# EAGLE schematic pandaLight (EAGLE 7.6.0)
DATABASE: ./../../universal-eagle/partsdb.txt

## Sheet 1 of 9: Power
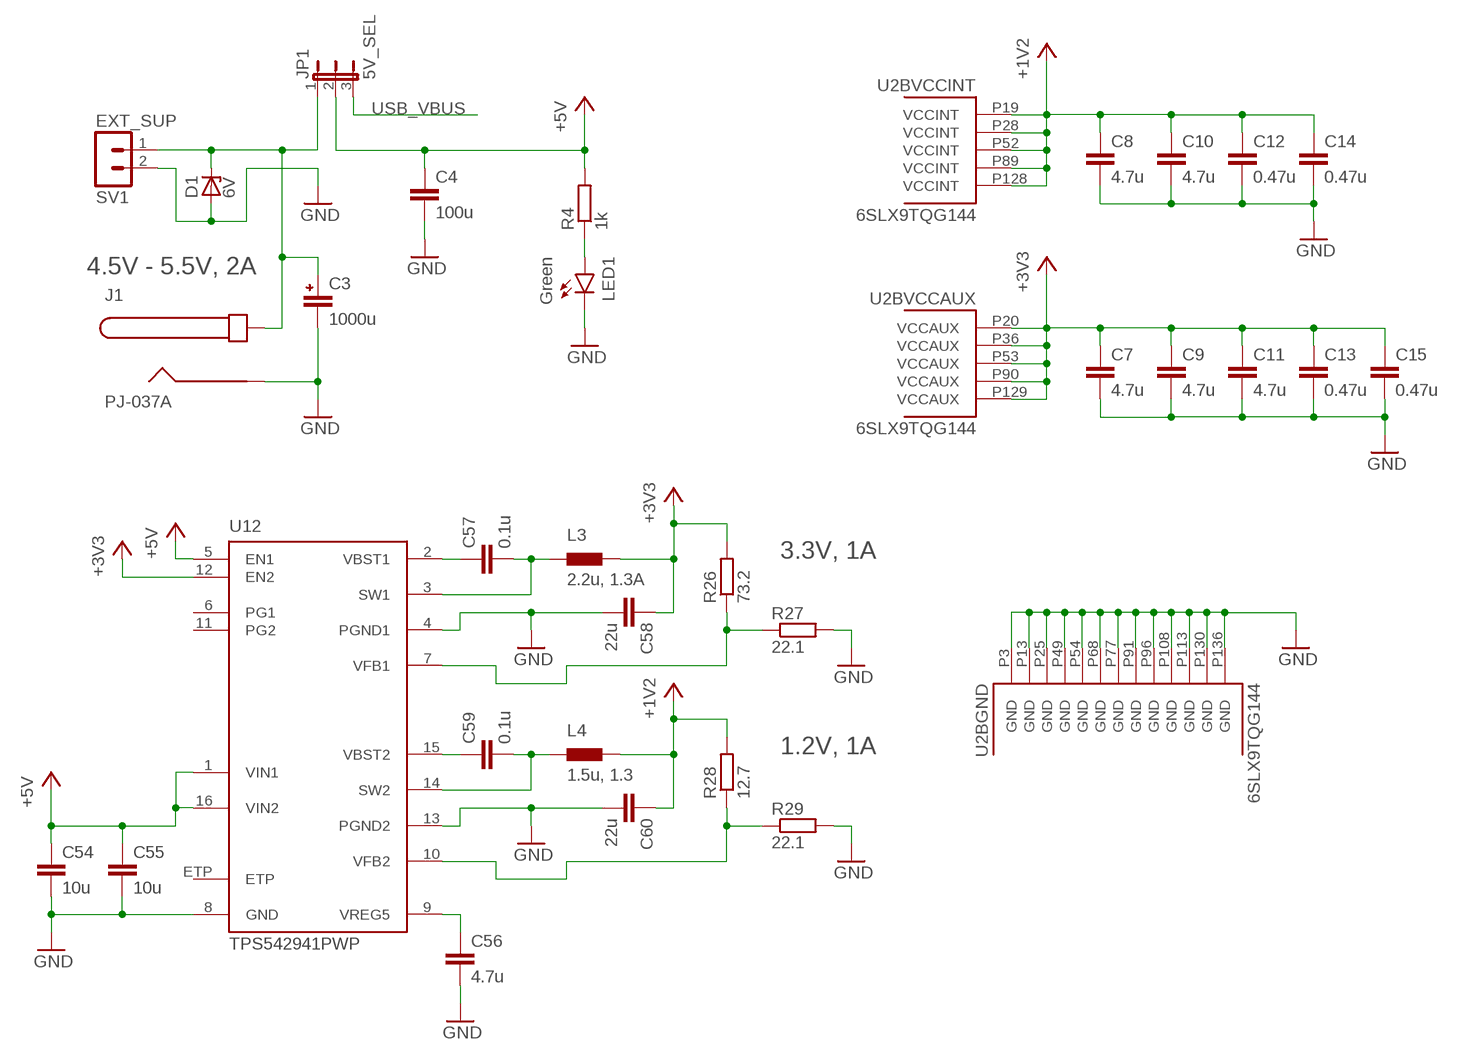
[diagram p0: schematic, sheet 1]

### Parts
C3  1000u  CAPACITOR_POL  [MVY_HA0]
C4  100u  CAPACITOR1206  [C1206]
C7  4.7u  CAPACITOR0603  [C0603]
C8  4.7u  CAPACITOR0603  [C0603]
C9  4.7u  CAPACITOR0603  [C0603]
C10  4.7u  CAPACITOR0603  [C0603]
C11  4.7u  CAPACITOR0603  [C0603]
C12  0.47u  CAPACITOR0402  [C0402]
C13  0.47u  CAPACITOR0402  [C0402]
C14  0.47u  CAPACITOR0402  [C0402]
C15  0.47u  CAPACITOR0402  [C0402]
C54  10u  CAPACITOR0603  [C0603]
C55  10u  CAPACITOR0603  [C0603]
C56  4.7u  CAPACITOR0603  [C0603]
C57  0.1u  CAPACITOR0402  [C0402]
C58  22u  CAPACITOR0603  [C0603]
C59  0.1u  CAPACITOR0402  [C0402]
C60  22u  CAPACITOR0603  [C0603]
D1  6V  ZENER_DIODE  [DO-214AC]
J1  PJ-037A  [PJ-037A]
JP1  5V_SEL  JP2E  [JP2]
L3  2.2u, 1.3A  SRN3015  [SRN3015_3X3]
L4  1.5u, 1.3  SRN3015  [SRN3015_3X3]
LED1  Green  LED0603  [LED-0603]
R4  1k  RESISTOR0402  [R0402]
R26  73.2  RESISTOR0402  [R0402]
R27  22.1  RESISTOR0402  [R0402]
R28  12.7  RESISTOR0402  [R0402]
R29  22.1  RESISTOR0402  [R0402]
SV1  EXT_SUP  MA02-1  [MA02-1]
U2  6SLX9TQG144  [TQ144]
U12  TPS542941PWP  [R-PDSO-G16]

### Nets
5V_SUP [power]: C3.1 D1.C J1.CENTER JP1.1 SV1.1 ; also sheet 4
+1V2: C8.1 C10.1 C12.1 C14.1 C60.1 L4.2 R28.2 U2.P19(BVCCINT:VCCINT) U2.P28(BVCCINT:VCCINT) U2.P52(BVCCINT:VCCINT) U2.P89(BVCCINT:VCCINT) U2.P128(BVCCINT:VCCINT)
+3V3 [power]: C7.1 C9.1 C11.1 C13.1 C15.1 C58.1 L3.2 R26.2 U2.P20(BVCCAUX:VCCAUX) U2.P36(BVCCAUX:VCCAUX) U2.P53(BVCCAUX:VCCAUX) U2.P90(BVCCAUX:VCCAUX) U2.P129(BVCCAUX:VCCAUX) U12.12(EN2) ; also sheet 2,3,4,5,6,7,8
+5V [power]: C4.1 C54.1 C55.1 JP1.2 R4.2 U12.1(VIN1) U12.5(EN1) U12.16(VIN2) ; also sheet 3,4,5,6,7
GND: C3.2 C4.2 C7.2 C8.2 C9.2 C10.2 C11.2 C12.2 C13.2 C14.2 C15.2 C54.2 C55.2 C56.2 C58.2 C60.2 D1.A J1.BARREL LED1.C R27.2 R29.2 SV1.2 U2.P3(BGND:GND) U2.P13(BGND:GND) U2.P25(BGND:GND) U2.P49(BGND:GND) U2.P54(BGND:GND) U2.P68(BGND:GND) U2.P77(BGND:GND) U2.P91(BGND:GND) U2.P96(BGND:GND) U2.P108(BGND:GND) U2.P113(BGND:GND) U2.P130(BGND:GND) U2.P136(BGND:GND) U12.4(PGND1) U12.8(GND) U12.13(PGND2) ; also sheet 2,3,4,5,6,7,8
N$3: C57.2 L3.1 U12.3(SW1)
N$4: R26.1 R27.1 U12.7(VFB1)
N$14: C57.1 U12.2(VBST1)
N$15: R28.1 R29.1 U12.10(VFB2)
N$16: C59.1 U12.15(VBST2)
N$20: C59.2 L4.1 U12.14(SW2)
N$47: LED1.A R4.1
USB_VBUS [power]: JP1.3 ; also sheet 2
VREG5: C56.1 U12.9(VREG5)
Unconnected: U12.6(PG1) U12.11(PG2) U12.ETP

### Notes on the sheet
- 4.5V - 5.5V, 2A
- 3.3V, 1A
- 1.2V, 1A

## Sheet 2 of 9: USB
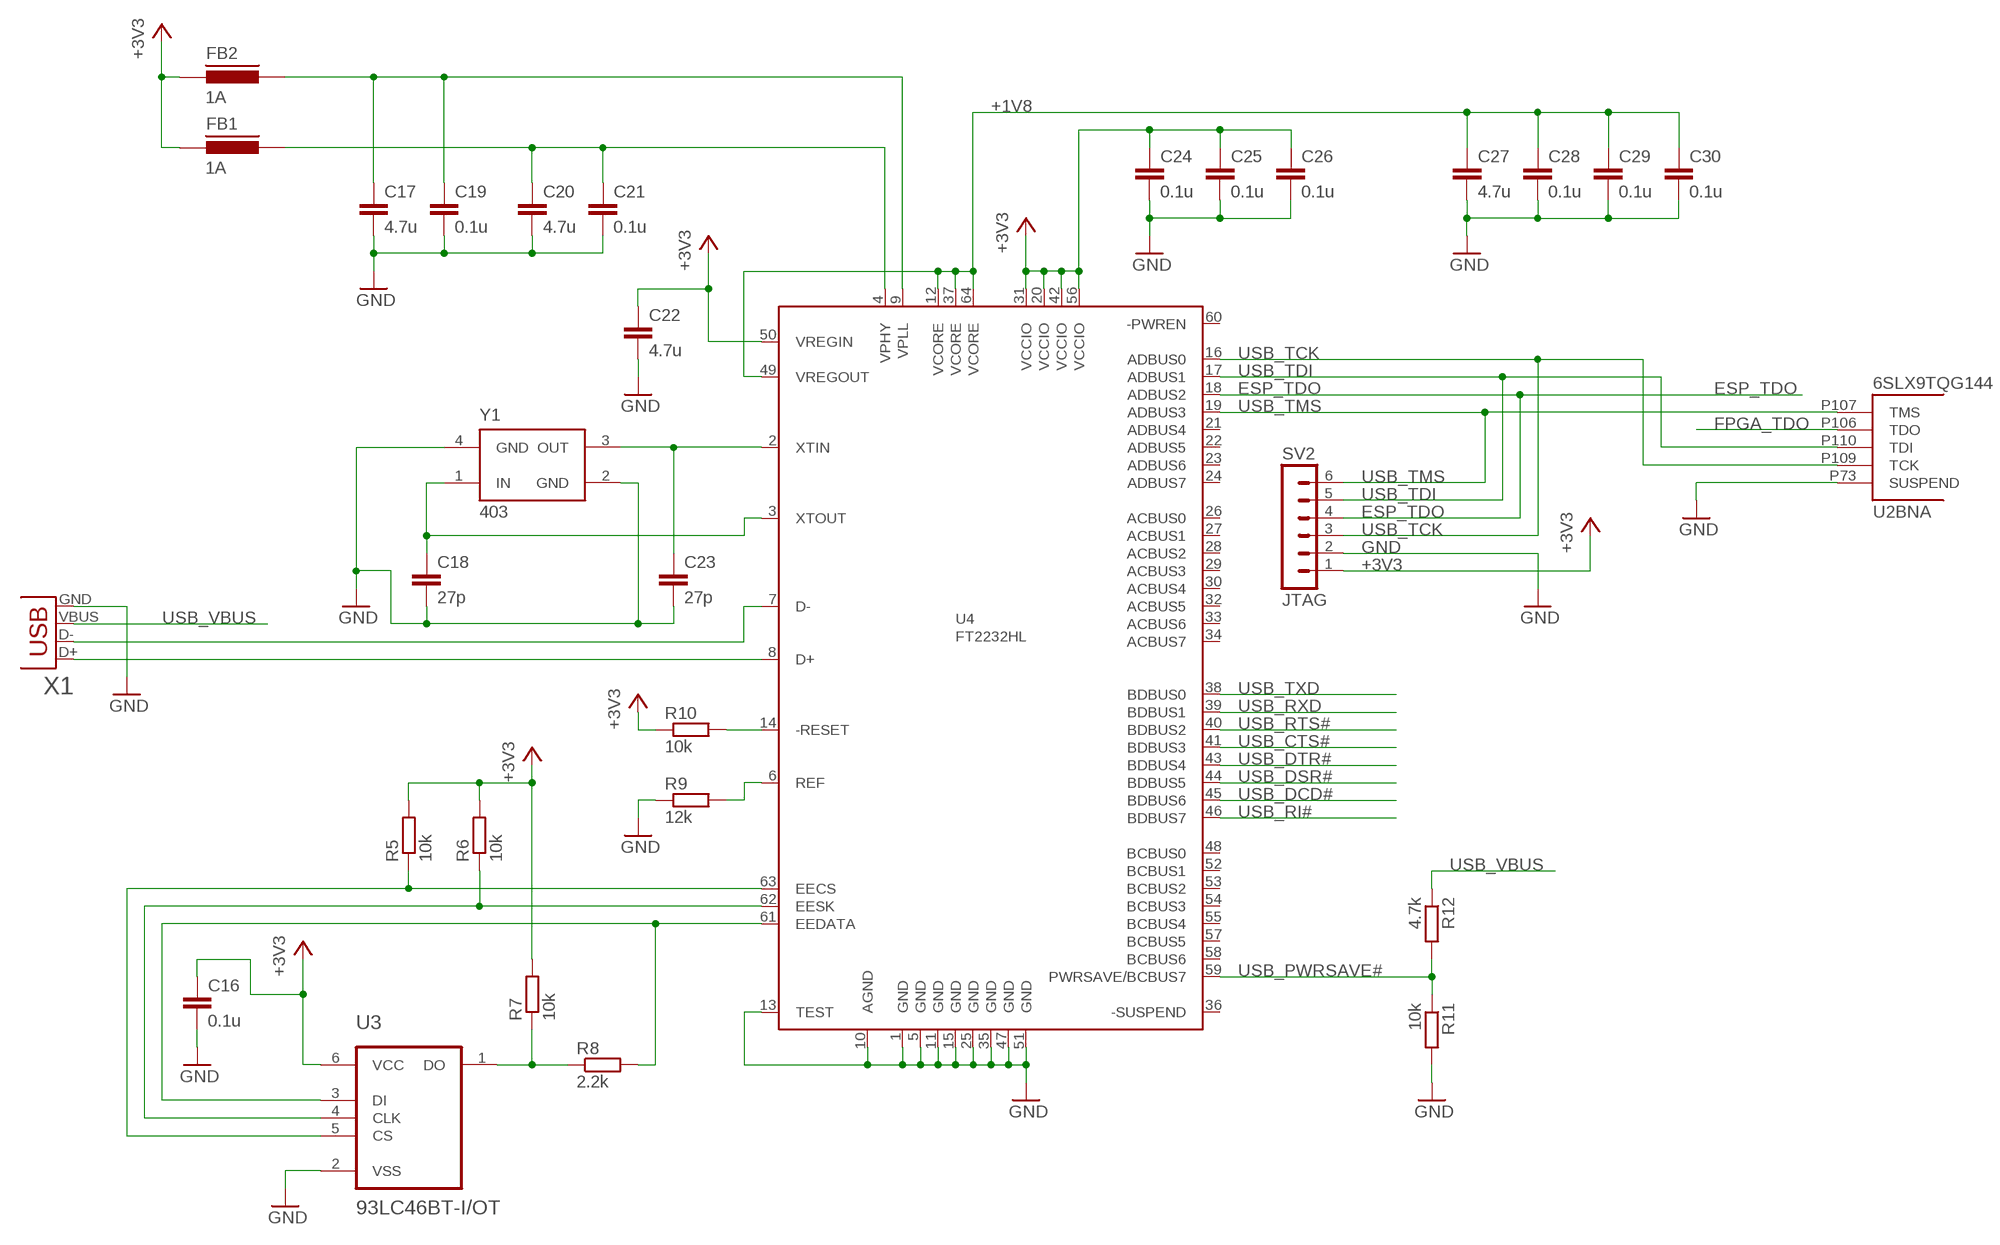
[diagram p1: schematic, sheet 2]

### Parts
C16  0.1u  CAPACITOR0402  [C0402]
C17  4.7u  CAPACITOR0603  [C0603]
C18  27p  CAPACITOR0402  [C0402]
C19  0.1u  CAPACITOR0402  [C0402]
C20  4.7u  CAPACITOR0603  [C0603]
C21  0.1u  CAPACITOR0402  [C0402]
C22  4.7u  CAPACITOR0603  [C0603]
C23  27p  CAPACITOR0402  [C0402]
C24  0.1u  CAPACITOR0402  [C0402]
C25  0.1u  CAPACITOR0402  [C0402]
C26  0.1u  CAPACITOR0402  [C0402]
C27  4.7u  CAPACITOR0603  [C0603]
C28  0.1u  CAPACITOR0402  [C0402]
C29  0.1u  CAPACITOR0402  [C0402]
C30  0.1u  CAPACITOR0402  [C0402]
FB1  1A  FERRITE0402  [FB0402]
FB2  1A  FERRITE0402  [FB0402]
R5  10k  RESISTOR0402  [R0402]
R6  10k  RESISTOR0402  [R0402]
R7  10k  RESISTOR0402  [R0402]
R8  2.2k  RESISTOR0402  [R0402]
R9  12k  RESISTOR0402  [R0402]
R10  10k  RESISTOR0402  [R0402]
R11  10k  RESISTOR0402  [R0402]
R12  4.7k  RESISTOR0402  [R0402]
SV2  JTAG  MA06-1  [MA06-1]
U3  93LC46BT-I/OT  [SOT23-6]
U4  FT2232HL  [LQFP64]
X1  USBUB-S  [USB-UB-S]
Y1  403  [403-3.2X2.5]

### Nets
+1V8 [power]: C27.1 C28.1 C29.1 C30.1 U4.12(VCORE) U4.37(VCORE) U4.49(VREGOUT) U4.64(VCORE)
+3V3 [power]: C16.1 C22.1 C24.1 C25.1 C26.1 FB1.1 FB2.1 R5.2 R6.2 R7.2 R10.1 SV2.1 U3.6(VCC) U4.20(VCCIO) U4.31(VCCIO) U4.42(VCCIO) U4.50(VREGIN) U4.56(VCCIO) ; also sheet 1,3,4,5,6,7,8
ESP_TDO: SV2.4 U4.18(ADBUS2) ; also sheet 8
FPGA_TDO: U2.P106(BNA:TDO) ; also sheet 8
GND: C16.2 C17.2 C18.2 C19.2 C20.2 C21.2 C22.2 C23.2 C24.2 C25.2 C26.2 C27.2 C28.2 C29.2 C30.2 R9.1 R11.2 SV2.2 U2.P73(BNA:SUSPEND) U3.2(VSS) U4.1(GND) U4.5(GND) U4.10(AGND) U4.11(GND) U4.13(TEST) U4.15(GND) U4.25(GND) U4.35(GND) U4.47(GND) U4.51(GND) X1.GND Y1.2(GND) Y1.4(GND) ; also sheet 1,3,4,5,6,7,8
N$1: C23.1 U4.2(XTIN) Y1.3(OUT)
N$5: C18.1 U4.3(XTOUT) Y1.1(IN)
N$6: R5.1 U3.5(CS) U4.63(EECS)
N$7: U4.7(D-) X1.D-
N$8: U4.8(D+) X1.D+
N$9: R6.1 U3.4(CLK) U4.62(EESK)
N$10: R8.2 U3.3(DI) U4.61(EEDATA)
N$11: R9.2 U4.6(REF)
N$12: R7.1 R8.1 U3.1(DO)
N$13: R10.2 U4.14(-RESET)
N$28: C20.1 C21.1 FB1.2 U4.4(VPHY)
N$31: C17.1 C19.1 FB2.2 U4.9(VPLL)
USB_CTS#: U4.41(BDBUS3) ; also sheet 4
USB_DCD#: U4.45(BDBUS6) ; also sheet 4
USB_DSR#: U4.44(BDBUS5) ; also sheet 4
USB_DTR#: U4.43(BDBUS4) ; also sheet 4
USB_PWRSAVE#: R11.1 R12.2 U4.59(PWRSAVE/BCBUS7)
USB_RI#: U4.46(BDBUS7) ; also sheet 4
USB_RTS#: U4.40(BDBUS2) ; also sheet 4
USB_RXD: U4.39(BDBUS1) ; also sheet 4
USB_TCK: SV2.3 U2.P109(BNA:TCK) U4.16(ADBUS0) ; also sheet 8
USB_TDI: SV2.5 U2.P110(BNA:TDI) U4.17(ADBUS1)
USB_TMS: SV2.6 U2.P107(BNA:TMS) U4.19(ADBUS3) ; also sheet 8
USB_TXD: U4.38(BDBUS0) ; also sheet 4
USB_VBUS [power]: R12.1 X1.VBUS ; also sheet 1
Unconnected: U4.21(ADBUS4) U4.22(ADBUS5) U4.23(ADBUS6) U4.24(ADBUS7) U4.26(ACBUS0) U4.27(ACBUS1) U4.28(ACBUS2) U4.29(ACBUS3) U4.30(ACBUS4) U4.32(ACBUS5) U4.33(ACBUS6) U4.34(ACBUS7) U4.36(-SUSPEND) U4.48(BCBUS0) U4.52(BCBUS1) U4.53(BCBUS2) U4.54(BCBUS3) U4.55(BCBUS4) U4.57(BCBUS5) U4.58(BCBUS6) U4.60(-PWREN)

## Sheet 3 of 9: B0, HDMI Rx0
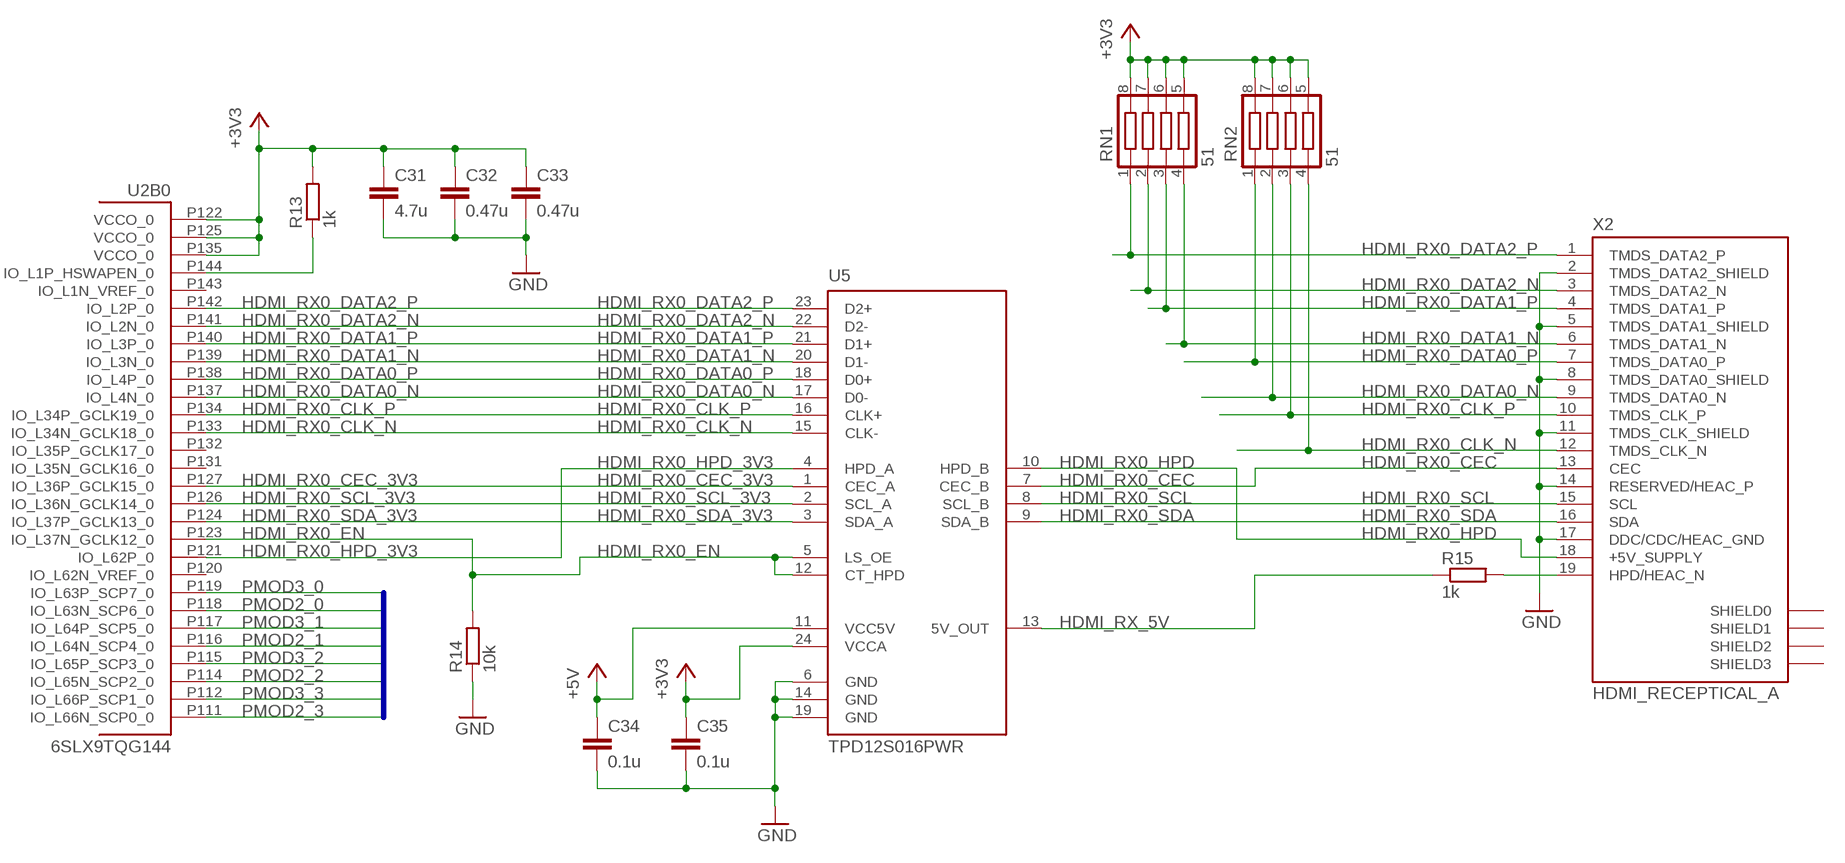
[diagram p2: schematic, sheet 3]

### Parts
C31  4.7u  CAPACITOR0603  [C0603]
C32  0.47u  CAPACITOR0402  [C0402]
C33  0.47u  CAPACITOR0402  [C0402]
C34  0.1u  CAPACITOR0402  [C0402]
C35  0.1u  CAPACITOR0402  [C0402]
R13  1k  RESISTOR0402  [R0402]
R14  10k  RESISTOR0402  [R0402]
R15  1k  RESISTOR0402  [R0402]
RN1  51  741C083  [741C083]
RN2  51  741C083  [741C083]
U5  TPD12S016PWR  [PW_R-PDSO-G24]
X2  HDMI_RECEPTICAL_A  [HDMI_TYPE_A_RECEPTICAL]

### Nets
+3V3 [power]: C31.1 C32.1 C33.1 C35.1 R13.2 RN1.5 RN1.6 RN1.7 RN1.8 RN2.5 RN2.6 RN2.7 RN2.8 U2.P122(B0:VCCO_0) U2.P125(B0:VCCO_0) U2.P135(B0:VCCO_0) U5.24(VCCA) ; also sheet 1,2,4,5,6,7,8
+5V [power]: C34.1 U5.11(VCC5V) ; also sheet 1,4,5,6,7
GND: C31.2 C32.2 C33.2 C34.2 C35.2 R14.1 U5.6(GND) U5.14(GND) U5.19(GND) X2.2(TMDS_DATA2_SHIELD) X2.5(TMDS_DATA1_SHIELD) X2.8(TMDS_DATA0_SHIELD) X2.11(TMDS_CLK_SHIELD) X2.14(RESERVED/HEAC_P) X2.17(DDC/CDC/HEAC_GND) ; also sheet 1,2,4,5,6,7,8
HDMI_RX0_CEC: U5.7(CEC_B) X2.13(CEC)
HDMI_RX0_CEC_3V3: U2.P127(B0:IO_L36P_GCLK15_0) U5.1(CEC_A)
HDMI_RX0_CLK_N [tmds]: RN2.4 U2.P133(B0:IO_L34N_GCLK18_0) U5.15(CLK-) X2.12(TMDS_CLK_N)
HDMI_RX0_CLK_P [tmds]: RN2.3 U2.P134(B0:IO_L34P_GCLK19_0) U5.16(CLK+) X2.10(TMDS_CLK_P)
HDMI_RX0_DATA0_N [tmds]: RN2.2 U2.P137(B0:IO_L4N_0) U5.17(D0-) X2.9(TMDS_DATA0_N)
HDMI_RX0_DATA0_P [tmds]: RN2.1 U2.P138(B0:IO_L4P_0) U5.18(D0+) X2.7(TMDS_DATA0_P)
HDMI_RX0_DATA1_N [tmds]: RN1.4 U2.P139(B0:IO_L3N_0) U5.20(D1-) X2.6(TMDS_DATA1_N)
HDMI_RX0_DATA1_P [tmds]: RN1.3 U2.P140(B0:IO_L3P_0) U5.21(D1+) X2.4(TMDS_DATA1_P)
HDMI_RX0_DATA2_N [tmds]: RN1.2 U2.P141(B0:IO_L2N_0) U5.22(D2-) X2.3(TMDS_DATA2_N)
HDMI_RX0_DATA2_P [tmds]: RN1.1 U2.P142(B0:IO_L2P_0) U5.23(D2+) X2.1(TMDS_DATA2_P)
HDMI_RX0_EN: R14.2 U2.P123(B0:IO_L37N_GCLK12_0) U5.5(LS_OE) U5.12(CT_HPD)
HDMI_RX0_HPD: U5.10(HPD_B) X2.18(+5V_SUPPLY)
HDMI_RX0_HPD_3V3: U2.P121(B0:IO_L62P_0) U5.4(HPD_A)
HDMI_RX0_SCL: U5.8(SCL_B) X2.15(SCL)
HDMI_RX0_SCL_3V3: U2.P126(B0:IO_L36N_GCLK14_0) U5.2(SCL_A)
HDMI_RX0_SDA: U5.9(SDA_B) X2.16(SDA)
HDMI_RX0_SDA_3V3: U2.P124(B0:IO_L37P_GCLK13_0) U5.3(SDA_A)
HDMI_RX_5V: R15.1 U5.13(5V_OUT)
N$35: R13.1 U2.P144(B0:IO_L1P_HSWAPEN_0)
N$50: R15.2 X2.19(HPD/HEAC_N)
PMOD2_0: U2.P118(B0:IO_L63N_SCP6_0) ; also sheet 7
PMOD2_1: U2.P116(B0:IO_L64N_SCP4_0) ; also sheet 7
PMOD2_2: U2.P114(B0:IO_L65N_SCP2_0) ; also sheet 7
PMOD2_3: U2.P111(B0:IO_L66N_SCP0_0) ; also sheet 7
PMOD3_0: U2.P119(B0:IO_L63P_SCP7_0) ; also sheet 7
PMOD3_1: U2.P117(B0:IO_L64P_SCP5_0) ; also sheet 7
PMOD3_2: U2.P115(B0:IO_L65P_SCP3_0) ; also sheet 7
PMOD3_3: U2.P112(B0:IO_L66P_SCP1_0) ; also sheet 7
Unconnected: U2.P120(B0:IO_L62N_VREF_0) U2.P131(B0:IO_L35N_GCLK16_0) U2.P132(B0:IO_L35P_GCLK17_0) U2.P143(B0:IO_L1N_VREF_0) X2.SHIELD0 X2.SHIELD1 X2.SHIELD2 X2.SHIELD3

### Buses
PMOD2_[0..3],PMOD3_[0..3]

## Sheet 4 of 9: B1, LEDs
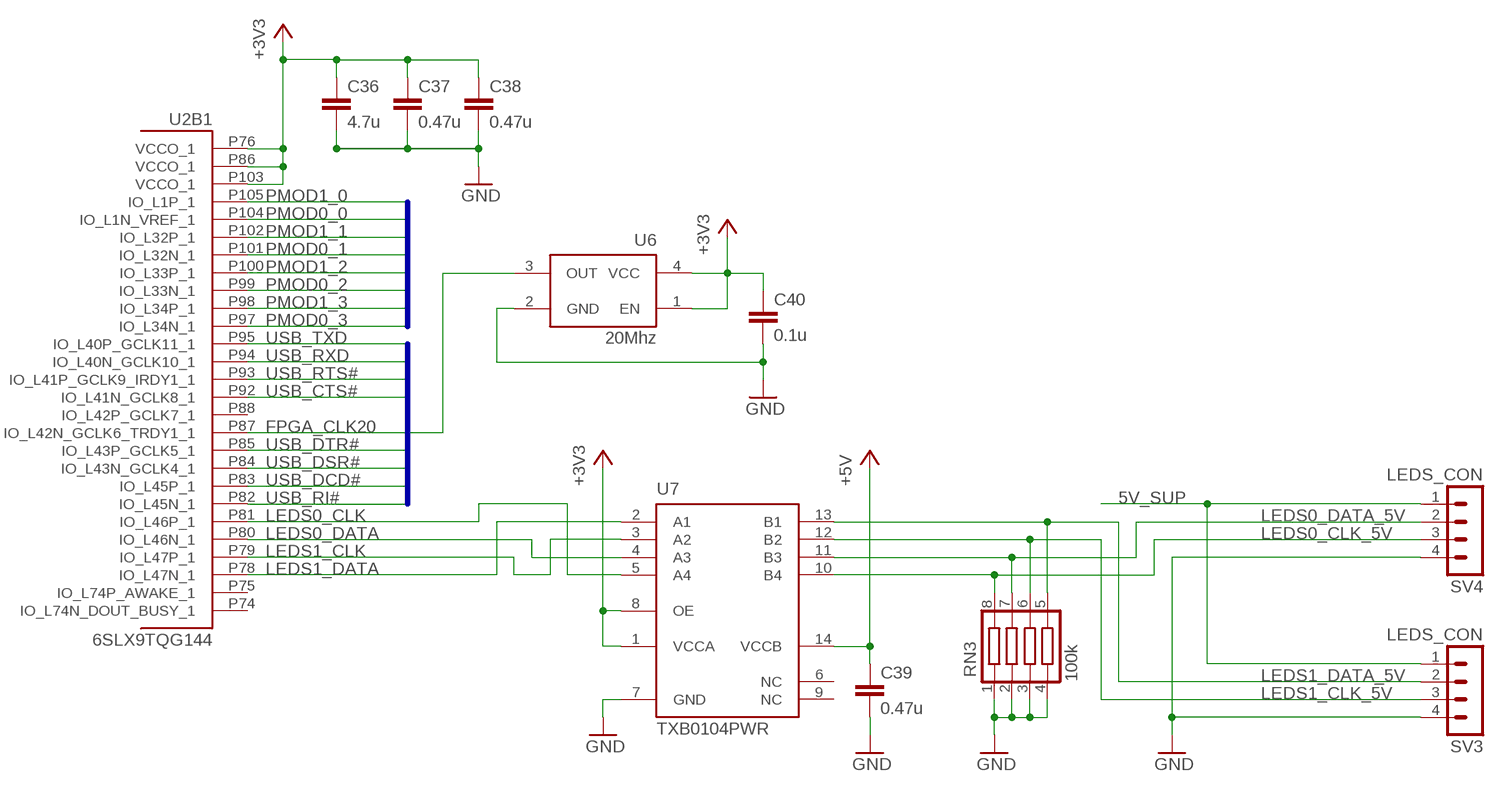
[diagram p3: schematic, sheet 4]

### Parts
C36  4.7u  CAPACITOR0603  [C0603]
C37  0.47u  CAPACITOR0402  [C0402]
C38  0.47u  CAPACITOR0402  [C0402]
C39  0.47u  CAPACITOR0402  [C0402]
C40  0.1u  CAPACITOR0402  [C0402]
RN3  100k  741C083  [741C083]
SV3  LEDS_CON  MA04-1  [MA04-1]
SV4  LEDS_CON  MA04-1  [MA04-1]
U6  20Mhz  OSCILLATOR  [OSCI-1.6X1.2]
U7  TXB0104PWR  [R-PDSO-G14]

### Nets
5V_SUP [power]: SV3.1 SV4.1 ; also sheet 1
+3V3 [power]: C36.1 C37.1 C38.1 C40.1 U2.P76(B1:VCCO_1) U2.P86(B1:VCCO_1) U2.P103(B1:VCCO_1) U6.1(EN) U6.4(VCC) U7.1(VCCA) U7.8(OE) ; also sheet 1,2,3,5,6,7,8
+5V [power]: C39.1 U7.14(VCCB) ; also sheet 1,3,5,6,7
FPGA_CLK20: U2.P87(B1:IO_L42N_GCLK6_TRDY1_1) U6.3(OUT)
GND: C36.2 C37.2 C38.2 C39.2 C40.2 RN3.1 RN3.2 RN3.3 RN3.4 SV3.4 SV4.4 U6.2(GND) U7.7(GND) ; also sheet 1,2,3,5,6,7,8
LEDS0_CLK: U2.P81(B1:IO_L46P_1) U7.5(A4)
LEDS0_CLK_5V: RN3.8 SV4.3 U7.10(B4)
LEDS0_DATA: U2.P80(B1:IO_L46N_1) U7.4(A3)
LEDS0_DATA_5V: RN3.7 SV4.2 U7.11(B3)
LEDS1_CLK: U2.P79(B1:IO_L47P_1) U7.3(A2)
LEDS1_CLK_5V: RN3.6 SV3.3 U7.12(B2)
LEDS1_DATA: U2.P78(B1:IO_L47N_1) U7.2(A1)
LEDS1_DATA_5V: RN3.5 SV3.2 U7.13(B1)
PMOD0_0: U2.P104(B1:IO_L1N_VREF_1) ; also sheet 7
PMOD0_1: U2.P101(B1:IO_L32N_1) ; also sheet 7
PMOD0_2: U2.P99(B1:IO_L33N_1) ; also sheet 7
PMOD0_3: U2.P97(B1:IO_L34N_1) ; also sheet 7
PMOD1_0: U2.P105(B1:IO_L1P_1) ; also sheet 7
PMOD1_1: U2.P102(B1:IO_L32P_1) ; also sheet 7
PMOD1_2: U2.P100(B1:IO_L33P_1) ; also sheet 7
PMOD1_3: U2.P98(B1:IO_L34P_1) ; also sheet 7
USB_CTS#: U2.P92(B1:IO_L41N_GCLK8_1) ; also sheet 2
USB_DCD#: U2.P83(B1:IO_L45P_1) ; also sheet 2
USB_DSR#: U2.P84(B1:IO_L43N_GCLK4_1) ; also sheet 2
USB_DTR#: U2.P85(B1:IO_L43P_GCLK5_1) ; also sheet 2
USB_RI#: U2.P82(B1:IO_L45N_1) ; also sheet 2
USB_RTS#: U2.P93(B1:IO_L41P_GCLK9_IRDY1_1) ; also sheet 2
USB_RXD: U2.P94(B1:IO_L40N_GCLK10_1) ; also sheet 2
USB_TXD: U2.P95(B1:IO_L40P_GCLK11_1) ; also sheet 2
Unconnected: U2.P74(B1:IO_L74N_DOUT_BUSY_1) U2.P75(B1:IO_L74P_AWAKE_1) U2.P88(B1:IO_L42P_GCLK7_1) U7.6(NC) U7.9(NC)

### Buses
PMOD0_[0..3],PMOD1_[0..3]
USB_RI#,USB_DCD#,USB_DSR#,USB_DTR#,USB_TXD,USB_RXD,USB_RTS#,USB_CTS#

## Sheet 5 of 9: B2, HDMI Tx
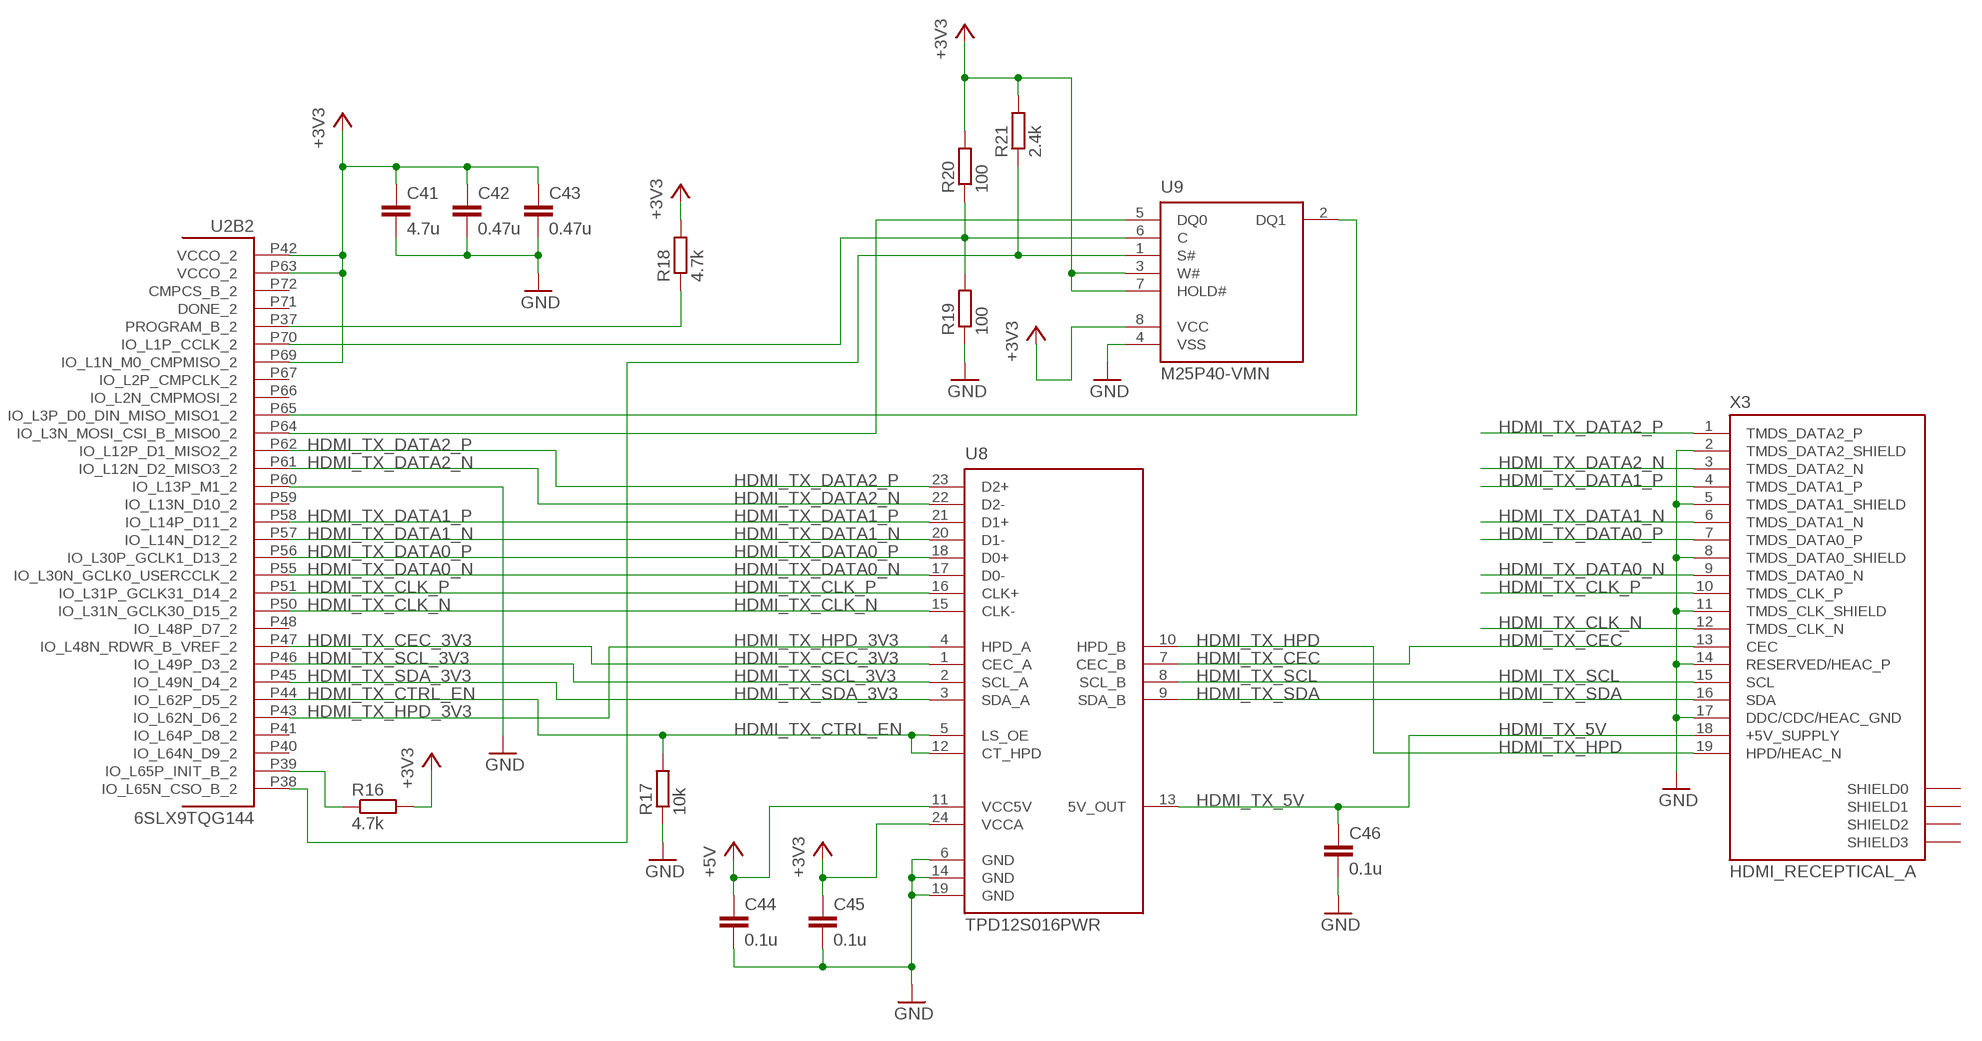
[diagram p4: schematic, sheet 5]

### Parts
C41  4.7u  CAPACITOR0603  [C0603]
C42  0.47u  CAPACITOR0402  [C0402]
C43  0.47u  CAPACITOR0402  [C0402]
C44  0.1u  CAPACITOR0402  [C0402]
C45  0.1u  CAPACITOR0402  [C0402]
C46  0.1u  CAPACITOR0402  [C0402]
R16  4.7k  RESISTOR0402  [R0402]
R17  10k  RESISTOR0402  [R0402]
R18  4.7k  RESISTOR0402  [R0402]
R19  100  RESISTOR0402  [R0402]
R20  100  RESISTOR0402  [R0402]
R21  2.4k  RESISTOR0402  [R0402]
U8  TPD12S016PWR  [PW_R-PDSO-G24]
U9  M25P40-VMN  [SO8N]
X3  HDMI_RECEPTICAL_A  [HDMI_TYPE_A_RECEPTICAL]

### Nets
+3V3 [power]: C41.1 C42.1 C43.1 C45.1 R16.2 R18.2 R20.2 R21.2 U2.P42(B2:VCCO_2) U2.P63(B2:VCCO_2) U2.P69(B2:IO_L1N_M0_CMPMISO_2) U8.24(VCCA) U9.3(W#) U9.7(HOLD#) U9.8(VCC) ; also sheet 1,2,3,4,6,7,8
+5V [power]: C44.1 U8.11(VCC5V) ; also sheet 1,3,4,6,7
GND: C41.2 C42.2 C43.2 C44.2 C45.2 C46.2 R17.1 R19.1 U2.P60(B2:IO_L13P_M1_2) U8.6(GND) U8.14(GND) U8.19(GND) U9.4(VSS) X3.2(TMDS_DATA2_SHIELD) X3.5(TMDS_DATA1_SHIELD) X3.8(TMDS_DATA0_SHIELD) X3.11(TMDS_CLK_SHIELD) X3.14(RESERVED/HEAC_P) X3.17(DDC/CDC/HEAC_GND) ; also sheet 1,2,3,4,6,7,8
HDMI_TX_5V [power]: C46.1 U8.13(5V_OUT) X3.18(+5V_SUPPLY)
HDMI_TX_CEC: U8.7(CEC_B) X3.13(CEC)
HDMI_TX_CEC_3V3: U2.P47(B2:IO_L48N_RDWR_B_VREF_2) U8.1(CEC_A)
HDMI_TX_CLK_N [tmds]: U2.P50(B2:IO_L31N_GCLK30_D15_2) U8.15(CLK-) X3.12(TMDS_CLK_N)
HDMI_TX_CLK_P [tmds]: U2.P51(B2:IO_L31P_GCLK31_D14_2) U8.16(CLK+) X3.10(TMDS_CLK_P)
HDMI_TX_CTRL_EN: R17.2 U2.P44(B2:IO_L62P_D5_2) U8.5(LS_OE) U8.12(CT_HPD)
HDMI_TX_DATA0_N [tmds]: U2.P55(B2:IO_L30N_GCLK0_USERCCLK_2) U8.17(D0-) X3.9(TMDS_DATA0_N)
HDMI_TX_DATA0_P [tmds]: U2.P56(B2:IO_L30P_GCLK1_D13_2) U8.18(D0+) X3.7(TMDS_DATA0_P)
HDMI_TX_DATA1_N [tmds]: U2.P57(B2:IO_L14N_D12_2) U8.20(D1-) X3.6(TMDS_DATA1_N)
HDMI_TX_DATA1_P [tmds]: U2.P58(B2:IO_L14P_D11_2) U8.21(D1+) X3.4(TMDS_DATA1_P)
HDMI_TX_DATA2_N [tmds]: U2.P61(B2:IO_L12N_D2_MISO3_2) U8.22(D2-) X3.3(TMDS_DATA2_N)
HDMI_TX_DATA2_P [tmds]: U2.P62(B2:IO_L12P_D1_MISO2_2) U8.23(D2+) X3.1(TMDS_DATA2_P)
HDMI_TX_HPD: U8.10(HPD_B) X3.19(HPD/HEAC_N)
HDMI_TX_HPD_3V3: U2.P43(B2:IO_L62N_D6_2) U8.4(HPD_A)
HDMI_TX_SCL: U8.8(SCL_B) X3.15(SCL)
HDMI_TX_SCL_3V3: U2.P46(B2:IO_L49P_D3_2) U8.2(SCL_A)
HDMI_TX_SDA: U8.9(SDA_B) X3.16(SDA)
HDMI_TX_SDA_3V3: U2.P45(B2:IO_L49N_D4_2) U8.3(SDA_A)
N$34: R18.1 U2.P37(B2:PROGRAM_B_2)
N$39: R16.1 U2.P39(B2:IO_L65P_INIT_B_2)
N$40: U2.P64(B2:IO_L3N_MOSI_CSI_B_MISO0_2) U9.5(DQ0)
N$41: R21.1 U2.P38(B2:IO_L65N_CSO_B_2) U9.1(S#)
N$42: R19.2 R20.1 U2.P70(B2:IO_L1P_CCLK_2) U9.6(C)
N$43: U2.P65(B2:IO_L3P_D0_DIN_MISO_MISO1_2) U9.2(DQ1)
Unconnected: U2.P40(B2:IO_L64N_D9_2) U2.P41(B2:IO_L64P_D8_2) U2.P48(B2:IO_L48P_D7_2) U2.P59(B2:IO_L13N_D10_2) U2.P66(B2:IO_L2N_CMPMOSI_2) U2.P67(B2:IO_L2P_CMPCLK_2) U2.P71(B2:DONE_2) U2.P72(B2:CMPCS_B_2) X3.SHIELD0 X3.SHIELD1 X3.SHIELD2 X3.SHIELD3

## Sheet 6 of 9: B3, HDMI Rx1, Bluetooth/WiFi
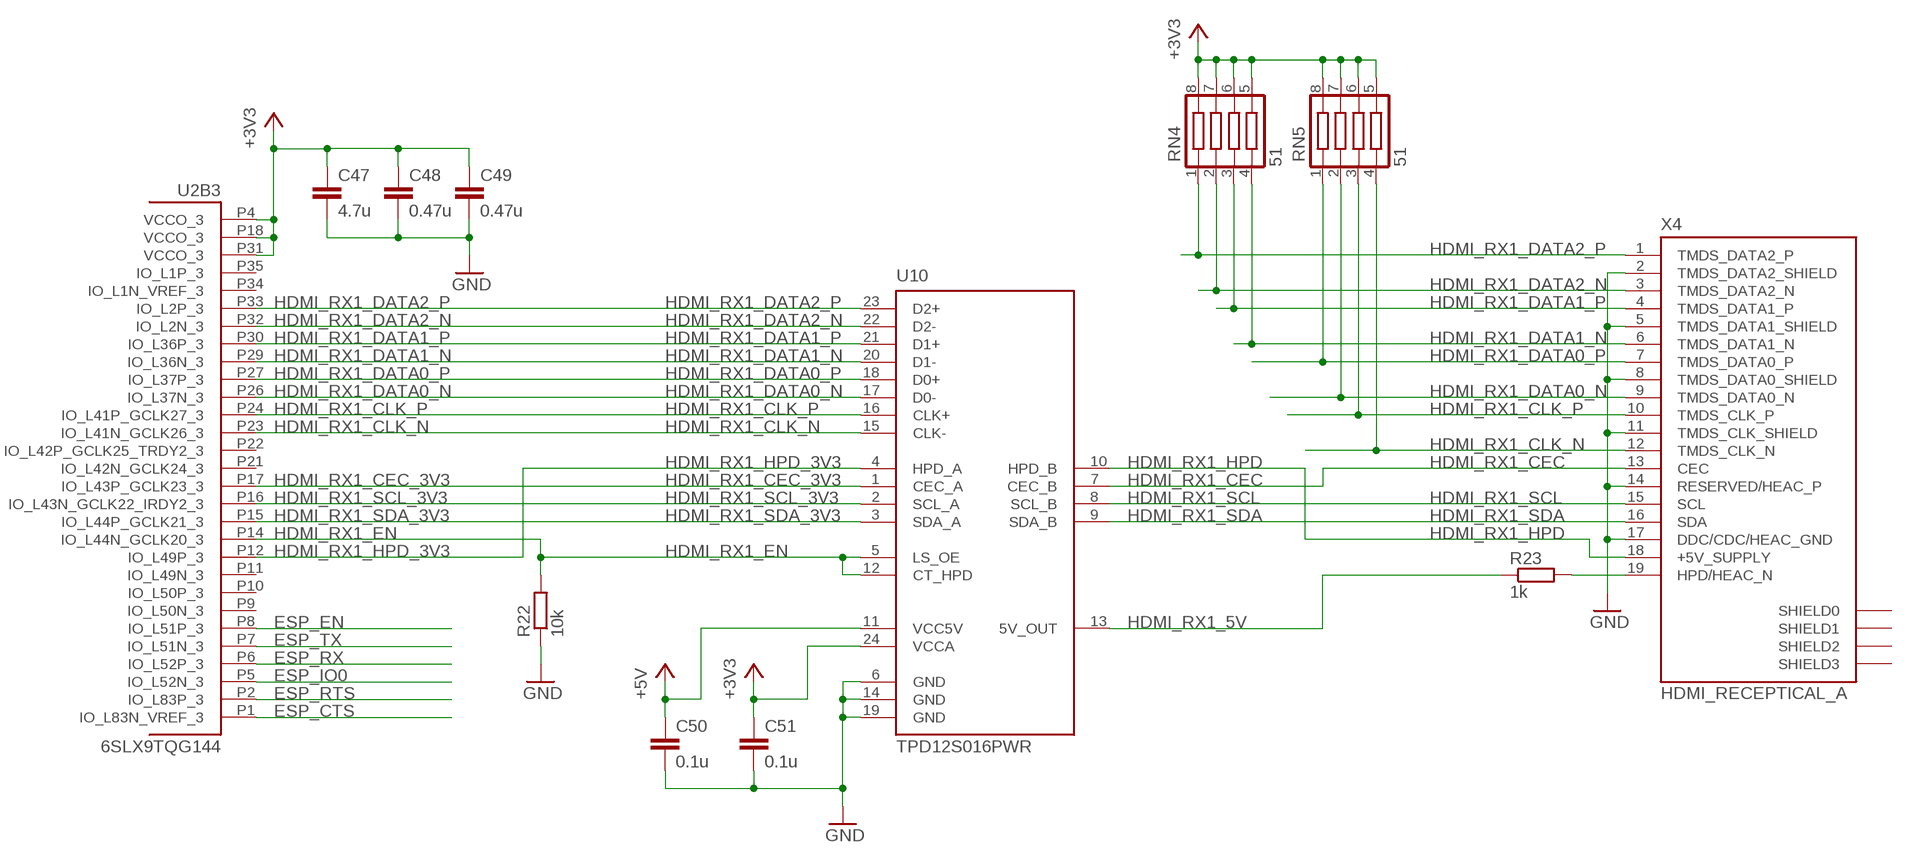
[diagram p5: schematic, sheet 6]

### Parts
C47  4.7u  CAPACITOR0603  [C0603]
C48  0.47u  CAPACITOR0402  [C0402]
C49  0.47u  CAPACITOR0402  [C0402]
C50  0.1u  CAPACITOR0402  [C0402]
C51  0.1u  CAPACITOR0402  [C0402]
R22  10k  RESISTOR0402  [R0402]
R23  1k  RESISTOR0402  [R0402]
RN4  51  741C083  [741C083]
RN5  51  741C083  [741C083]
U10  TPD12S016PWR  [PW_R-PDSO-G24]
X4  HDMI_RECEPTICAL_A  [HDMI_TYPE_A_RECEPTICAL]

### Nets
+3V3 [power]: C47.1 C48.1 C49.1 C51.1 RN4.5 RN4.6 RN4.7 RN4.8 RN5.5 RN5.6 RN5.7 RN5.8 U2.P4(B3:VCCO_3) U2.P18(B3:VCCO_3) U2.P31(B3:VCCO_3) U10.24(VCCA) ; also sheet 1,2,3,4,5,7,8
+5V [power]: C50.1 U10.11(VCC5V) ; also sheet 1,3,4,5,7
ESP_CTS: U2.P1(B3:IO_L83N_VREF_3) ; also sheet 8
ESP_EN: U2.P8(B3:IO_L51P_3) ; also sheet 8
ESP_IO0: U2.P5(B3:IO_L52N_3) ; also sheet 8
ESP_RTS: U2.P2(B3:IO_L83P_3) ; also sheet 8
ESP_RX: U2.P6(B3:IO_L52P_3) ; also sheet 8
ESP_TX: U2.P7(B3:IO_L51N_3) ; also sheet 8
GND: C47.2 C48.2 C49.2 C50.2 C51.2 R22.1 U10.6(GND) U10.14(GND) U10.19(GND) X4.2(TMDS_DATA2_SHIELD) X4.5(TMDS_DATA1_SHIELD) X4.8(TMDS_DATA0_SHIELD) X4.11(TMDS_CLK_SHIELD) X4.14(RESERVED/HEAC_P) X4.17(DDC/CDC/HEAC_GND) ; also sheet 1,2,3,4,5,7,8
HDMI_RX1_5V: R23.1 U10.13(5V_OUT)
HDMI_RX1_CEC: U10.7(CEC_B) X4.13(CEC)
HDMI_RX1_CEC_3V3: U2.P17(B3:IO_L43P_GCLK23_3) U10.1(CEC_A)
HDMI_RX1_CLK_N [tmds]: RN5.4 U2.P23(B3:IO_L41N_GCLK26_3) U10.15(CLK-) X4.12(TMDS_CLK_N)
HDMI_RX1_CLK_P [tmds]: RN5.3 U2.P24(B3:IO_L41P_GCLK27_3) U10.16(CLK+) X4.10(TMDS_CLK_P)
HDMI_RX1_DATA0_N [tmds]: RN5.2 U2.P26(B3:IO_L37N_3) U10.17(D0-) X4.9(TMDS_DATA0_N)
HDMI_RX1_DATA0_P [tmds]: RN5.1 U2.P27(B3:IO_L37P_3) U10.18(D0+) X4.7(TMDS_DATA0_P)
HDMI_RX1_DATA1_N [tmds]: RN4.4 U2.P29(B3:IO_L36N_3) U10.20(D1-) X4.6(TMDS_DATA1_N)
HDMI_RX1_DATA1_P [tmds]: RN4.3 U2.P30(B3:IO_L36P_3) U10.21(D1+) X4.4(TMDS_DATA1_P)
HDMI_RX1_DATA2_N [tmds]: RN4.2 U2.P32(B3:IO_L2N_3) U10.22(D2-) X4.3(TMDS_DATA2_N)
HDMI_RX1_DATA2_P [tmds]: RN4.1 U2.P33(B3:IO_L2P_3) U10.23(D2+) X4.1(TMDS_DATA2_P)
HDMI_RX1_EN: R22.2 U2.P14(B3:IO_L44N_GCLK20_3) U10.5(LS_OE) U10.12(CT_HPD)
HDMI_RX1_HPD: U10.10(HPD_B) X4.18(+5V_SUPPLY)
HDMI_RX1_HPD_3V3: U2.P12(B3:IO_L49P_3) U10.4(HPD_A)
HDMI_RX1_SCL: U10.8(SCL_B) X4.15(SCL)
HDMI_RX1_SCL_3V3: U2.P16(B3:IO_L43N_GCLK22_IRDY2_3) U10.2(SCL_A)
HDMI_RX1_SDA: U10.9(SDA_B) X4.16(SDA)
HDMI_RX1_SDA_3V3: U2.P15(B3:IO_L44P_GCLK21_3) U10.3(SDA_A)
N$2: R23.2 X4.19(HPD/HEAC_N)
Unconnected: U2.P9(B3:IO_L50N_3) U2.P10(B3:IO_L50P_3) U2.P11(B3:IO_L49N_3) U2.P21(B3:IO_L42N_GCLK24_3) U2.P22(B3:IO_L42P_GCLK25_TRDY2_3) U2.P34(B3:IO_L1N_VREF_3) U2.P35(B3:IO_L1P_3) X4.SHIELD0 X4.SHIELD1 X4.SHIELD2 X4.SHIELD3

## Sheet 7 of 9: PMOD
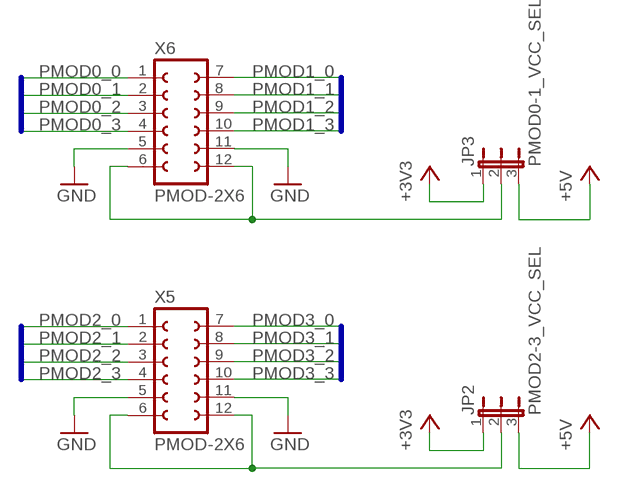
[diagram p6: schematic, sheet 7]

### Parts
JP2  PMOD2-3_VCC_SEL  JP2E  [JP2]
JP3  PMOD0-1_VCC_SEL  JP2E  [JP2]
X5  PMOD-2X6  [PMOD-2X6]
X6  PMOD-2X6  [PMOD-2X6]

### Nets
+3V3 [power]: JP2.1 JP3.1 ; also sheet 1,2,3,4,5,6,8
+5V [power]: JP2.3 JP3.3 ; also sheet 1,3,4,5,6
GND: X5.5 X5.11 X6.5 X6.11 ; also sheet 1,2,3,4,5,6,8
N$49: JP2.2 X5.6 X5.12
N$51: JP3.2 X6.6 X6.12
PMOD0_0: X6.1 ; also sheet 4
PMOD0_1: X6.2 ; also sheet 4
PMOD0_2: X6.3 ; also sheet 4
PMOD0_3: X6.4 ; also sheet 4
PMOD1_0: X6.7 ; also sheet 4
PMOD1_1: X6.8 ; also sheet 4
PMOD1_2: X6.9 ; also sheet 4
PMOD1_3: X6.10 ; also sheet 4
PMOD2_0: X5.1 ; also sheet 3
PMOD2_1: X5.2 ; also sheet 3
PMOD2_2: X5.3 ; also sheet 3
PMOD2_3: X5.4 ; also sheet 3
PMOD3_0: X5.7 ; also sheet 3
PMOD3_1: X5.8 ; also sheet 3
PMOD3_2: X5.9 ; also sheet 3
PMOD3_3: X5.10 ; also sheet 3

### Buses
PMOD0_[0..3]
PMOD1_[0..3]
PMOD2_[0..3]
PMOD3_[0..3]

## Sheet 8 of 9: Bluetooth/WiFi
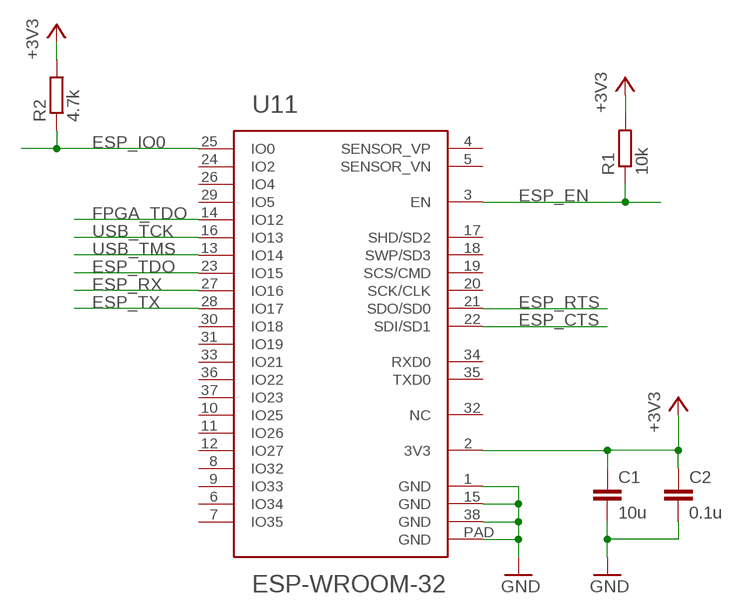
[diagram p7: schematic, sheet 8]

### Parts
C1  10u  CAPACITOR0603  [C0603]
C2  0.1u  CAPACITOR0402  [C0402]
R1  10k  RESISTOR0402  [R0402]
R2  4.7k  RESISTOR0402  [R0402]
U11  ESP-WROOM-32  [ESP-WROOM-32]

### Nets
+3V3 [power]: C1.1 C2.1 R1.2 R2.2 U11.2(3V3) ; also sheet 1,2,3,4,5,6,7
ESP_CTS: U11.22(SDI/SD1) ; also sheet 6
ESP_EN: R1.1 U11.3(EN) ; also sheet 6
ESP_IO0: R2.1 U11.25(IO0) ; also sheet 6
ESP_RTS: U11.21(SDO/SD0) ; also sheet 6
ESP_RX: U11.27(IO16) ; also sheet 6
ESP_TDO: U11.23(IO15) ; also sheet 2
ESP_TX: U11.28(IO17) ; also sheet 6
FPGA_TDO: U11.14(IO12) ; also sheet 2
GND: C1.2 C2.2 U11.1(GND) U11.15(GND) U11.38(GND) U11.PAD(GND) ; also sheet 1,2,3,4,5,6,7
USB_TCK: U11.16(IO13) ; also sheet 2
USB_TMS: U11.13(IO14) ; also sheet 2
Unconnected: U11.4(SENSOR_VP) U11.5(SENSOR_VN) U11.6(IO34) U11.7(IO35) U11.8(IO32) U11.9(IO33) U11.10(IO25) U11.11(IO26) U11.12(IO27) U11.17(SHD/SD2) U11.18(SWP/SD3) U11.19(SCS/CMD) U11.20(SCK/CLK) U11.24(IO2) U11.26(IO4) U11.29(IO5) U11.30(IO18) U11.31(IO19) U11.32(NC) U11.33(IO21) U11.34(RXD0) U11.35(TXD0) U11.36(IO22) U11.37(IO23)

## Sheet 9 of 9: misc
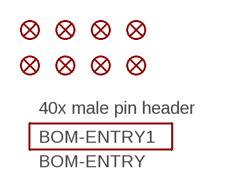
[diagram p8: schematic, sheet 9]
BOM-ENTRY1 (BOM-ENTRY): DESC: 40x male pin header; PARTNO: PREC040SAAN-RC

### Parts
FID1  FIDUCIAL1X2  [FIDUCIAL-1X2]
FID2  FIDUCIAL1X2  [FIDUCIAL-1X2]
FID3  FIDUCIAL1X2  [FIDUCIAL-1X2]
FID4  FIDUCIAL1X2  [FIDUCIAL-1X2]
FID5  FIDUCIAL1X2  [FIDUCIAL-1X2]
FID6  FIDUCIAL1X2  [FIDUCIAL-1X2]
FID7  FIDUCIAL1X2  [FIDUCIAL-1X2]
FID8  FIDUCIAL1X2  [FIDUCIAL-1X2]

## Library data of the parts
C1 = pandaLight:CAPACITOR: generic capacitor
C2 C16 C19 C21 C24-C26 C28-C30 C34 C35 C40 C44-C46 C50 C51 C57 C59 = pandaLight:CAPACITOR: generic capacitor; PARTNO: CL05B104KP5NNNC
C3 = pandaLight:CAPACITOR_POL: generic polarized capacitor; PARTNO: EMVY6R3ADA102MHA0G
C4 = pandaLight:CAPACITOR: generic capacitor; PARTNO: CL31A107MQHNNNE
C7-C11 C17 C20 C22 C27 C31 C36 C41 C47 C56 = pandaLight:CAPACITOR: generic capacitor; PARTNO: C0603C475K9PACTU
C12-C15 C32 C33 C37-C39 C42 C43 C48 C49 = pandaLight:CAPACITOR: generic capacitor; PARTNO: C1005X5R0J474K050BB
C18 C23 = pandaLight:CAPACITOR: generic capacitor; PARTNO: CL05C270JB5NNNC
C54 C55 = pandaLight:CAPACITOR: generic capacitor; PARTNO: CL10A106MQ8NNNC
C58 C60 = pandaLight:CAPACITOR: generic capacitor; PARTNO: CL10A226MQ8NRNC
D1 = pandaLight:ZENER_DIODE: generic ZENER diode; PARTNO: SMAJ6.0A
FB1 FB2 = pandaLight:FERRITE: generic ferrite bead; PARTNO: BK1005HS100-T
FID1-FID8 = pandaLight:FIDUCIAL: Fiducial Alignment Points Various fiducial points for machine vision alignment.; BOM: EXCLUDE
J1 = pandaLight:PJ-037A: DC Power Jack; PARTNO: PJ-037A
JP1-JP3 = pandaLight:JP2E: 3-pin jumper; PARTNO: SPC02SYAN
L3 = pandaLight:SRN3015: semi-shielded power inductors; PARTNO: SRN3015-2R2M
L4 = pandaLight:SRN3015: semi-shielded power inductors; PARTNO: SRN3015-1R5Y
LED1 = pandaLight:LED: generic LED; PARTNO: LTST-C191KGKT
R1 R2 R5-R7 R10 R11 R14 R17 R22 = pandaLight:RESISTOR: generic resistor; PARTNO: ERJ-2RKF1002X
R4 R13 R15 R23 = pandaLight:RESISTOR: generic resistor; PARTNO: ERJ-2RKF1001X
R8 = pandaLight:RESISTOR: generic resistor; PARTNO: ERJ-2RKF2201X
R9 = pandaLight:RESISTOR: generic resistor; PARTNO: ERJ-2RKF1202X
R12 R16 R18 = pandaLight:RESISTOR: generic resistor; PARTNO: ERJ-2RKF4701X
R19 R20 = pandaLight:RESISTOR: generic resistor; PARTNO: ERJ-2GEJ101X
R21 = pandaLight:RESISTOR: generic resistor; PARTNO: ERJ-2RKF2401X
R26 = pandaLight:RESISTOR: generic resistor; PARTNO: ERJ-2RKF73R2X
R27 R29 = pandaLight:RESISTOR: generic resistor; PARTNO: ERJ-2RKF22R1X
R28 = pandaLight:RESISTOR: generic resistor; PARTNO: ERJ-2RKF12R7X
RN1 RN2 RN4 RN5 = pandaLight:741C083: 4 element chip resistor array; PARTNO: 741C083510JP
RN3 = pandaLight:741C083: 4 element chip resistor array; PARTNO: 741C083104JP
SV1 = pandaLight:MA02-1: 2-pin male header; BOM: EXCLUDE; PARTNO: *
SV2 = pandaLight:MA06-1: 6-pin male header; BOM: EXCLUDE; PARTNO: *
SV3 SV4 = pandaLight:MA04-1: 4-pin male header; BOM: EXCLUDE; PARTNO: *
U2 = pandaLight:6SLX9TQG144: Xilinx FPGA: 6SLX9TQG144; PARTNO: XC6SLX9-3TQG144C
U3 = pandaLight:93LC46BT-I: 1K Microwire Compatible Serial EEPROM; PARTNO: 93LC46BT-I/OT
U4 = pandaLight:FT2232H: FT2232H USB2.0 High speed dual Serial/FIFO controller 64 pin device; PARTNO: FT2232HL-REEL
U5 U8 U10 = pandaLight:TPD12S016: HDMI Companion Chip; PARTNO: TPD12S016PWR
U6 = pandaLight:OSCILLATOR; PARTNO: ASCO-20.000MHZ-EK-T3
U7 = pandaLight:TXB0104: 4-bit bidirectional voltage-level translator; PARTNO: TXB0104PWR
U9 = pandaLight:M25P40-V: 4MBit SPI NOR Flash; PARTNO: M25P80-VMN6TP
U11 = pandaLight:ESP-WROOM-32: ESP-WROOM-32 is a powerful, generic WiFi-BT-BLE MCU module that targets a wide variety of applications, ranging from low-power sensor networks to the most demanding tasks, such as voice encoding, music streaming and MP3 decoding.
U12 = pandaLight:TPS542941: 2A/3A dual channel synchronous step-down switcher with integrated FET; PARTNO: TPS542941PWP
X1 = pandaLight:USB: USB Connectors; PARTNO: 10118192-0001LF
X2-X4 = pandaLight:HDMI_RECEPTICAL: HDMI receptical; PARTNO: 10029449-111RLF
X5 X6 = pandaLight:PMOD-2X6: 2x6 PMOD connector; PARTNO: PPTC062LJBN-RC
Y1 = pandaLight:403: Surface Mount Quartz Crystal; PARTNO: 403C35D12M00000

## Net classes
0 default: width 0.152 mm, clearance 0.152 mm
1 power: width 0.152 mm, clearance 0.152 mm
2 tmds: width 0.152 mm, clearance 0.152 mm